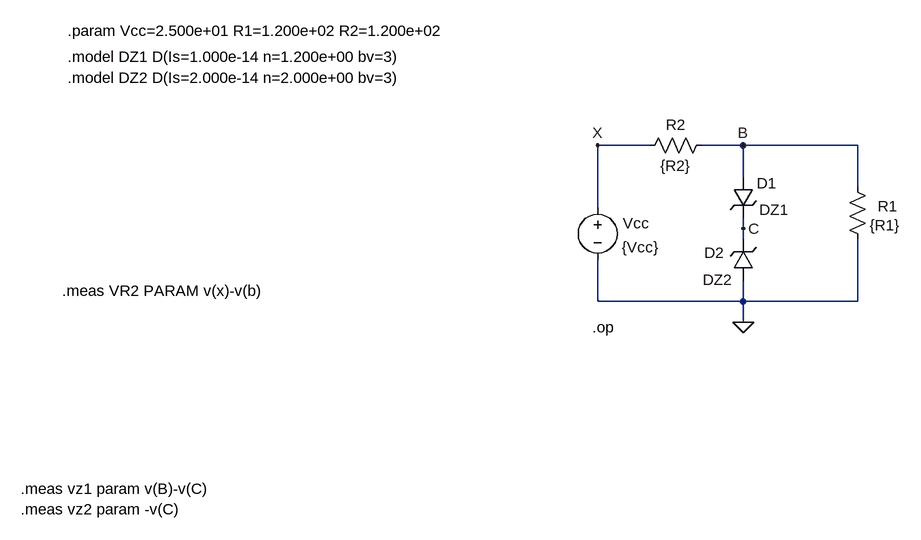
[diagram p0: schematic COMB01op.asc]
COMB01op.asc, the LTspice schematic file:
Version 4
SHEET 1 1608 1076
WIRE 944 -176 864 -176
WIRE 1088 -176 1024 -176
WIRE 1264 -176 1088 -176
WIRE 1088 -128 1088 -176
WIRE 1264 -112 1264 -176
WIRE 864 -80 864 -176
WIRE 1088 -48 1088 -64
WIRE 1088 -32 1088 -48
WIRE 864 64 864 0
WIRE 1088 64 1088 32
WIRE 1088 64 864 64
WIRE 1264 64 1264 -32
WIRE 1264 64 1088 64
WIRE 1088 96 1088 64
FLAG 1088 96 0
FLAG 1088 -176 B
FLAG 1088 -48 C
FLAG 864 -176 X
SYMBOL voltage 864 -96 R0
WINDOW 123 0 0 Left 0
WINDOW 39 0 0 Left 0
WINDOW 0 39 40 Left 2
WINDOW 3 37 77 Left 2
SYMATTR InstName Vcc
SYMATTR Value {Vcc}
SYMBOL res 1248 -128 R0
WINDOW 0 47 46 Left 2
WINDOW 3 35 75 Left 2
SYMATTR InstName R1
SYMATTR Value {R1}
SYMBOL res 1040 -192 R90
WINDOW 0 0 56 VBottom 2
WINDOW 3 32 56 VTop 2
SYMATTR InstName R2
SYMATTR Value {R2}
SYMBOL zener 1072 -128 R0
WINDOW 0 37 10 Left 2
WINDOW 3 41 51 Left 2
SYMATTR InstName D1
SYMATTR Value DZ1
SYMBOL zener 1104 32 R180
WINDOW 0 45 43 Left 2
WINDOW 3 32 1 Left 2
SYMATTR InstName D2
SYMATTR Value DZ2
TEXT 856 104 Left 2 !.op
TEXT 48 -352 Left 2 !.param Vcc=2.500e+01 R1=1.200e+02 R2=1.200e+02
TEXT 48 -312 Left 2 !.model DZ1 D(Is=1.000e-14 n=1.200e+00 bv=3)
TEXT 48 -280 Left 2 !.model DZ2 D(Is=2.000e-14 n=2.000e+00 bv=3)
TEXT -24 352 Left 2 !.meas vz1 param v(B)-v(C)
TEXT -24 384 Left 2 !.meas vz2 param -v(C)
TEXT 40 48 Left 2 !.meas VR2 PARAM v(x)-v(b)

The netlist it stands for:
* COMB01op.asc
Vcc X 0 {Vcc}
R1 B 0 {R1}
R2 B X {R2}
D1 B C DZ1
D2 0 C DZ2
.model D D
.lib standard.dio
.op
.param Vcc=2.500e+01 R1=1.200e+02 R2=1.200e+02
.model DZ1 D(Is=1.000e-14 n=1.200e+00 bv=3)
.model DZ2 D(Is=2.000e-14 n=2.000e+00 bv=3)
.meas vz1 param v(B)-v(C)
.meas vz2 param -v(C)
.meas VR2 PARAM v(x)-v(b)
.backanno
.end